# Altium schematic sheet preamp.SchDoc
size A4
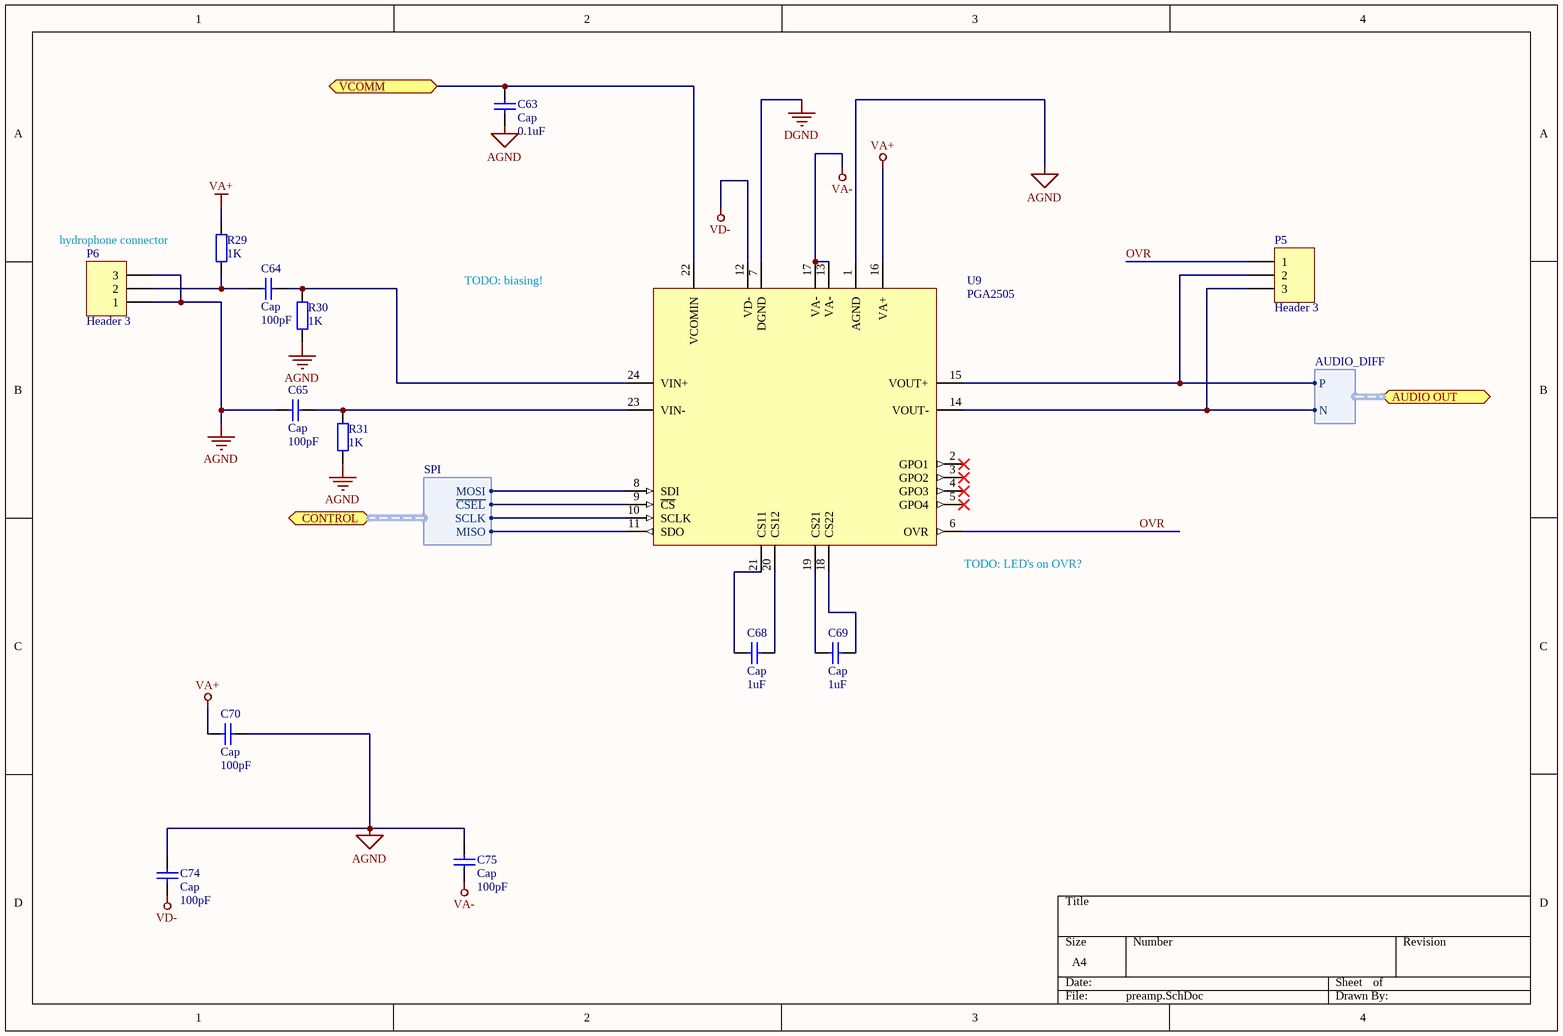
[diagram p0: preamp.SchDoc]

## Parts
C63  Cap  value 0.1uF  [C0603]
C64  Cap  value 100pF  [C0603]
C65  Cap  value 100pF  [C0603]
C68  Cap  value 1uF  [C0603]
C69  Cap  value 1uF  [C0603]
C70  Cap  value 100pF  [C0603]
C74  Cap  value 100pF  [C0603]
C75  Cap  value 100pF  [C0603]
P5  Header 3  [HDR1X3]
P6  Header 3  [S03B-PASK-2]
R29  value 1K  [R0603]  (hidden comment: Res2)
R30  value 1K  [R0603]  (hidden comment: Res2)
R31  value 1K  [R0603]  (hidden comment: Res2)
U9  PGA2505  [SOP65P780X200-24N]

## Ports
AUDIO OUT (harness AUDIO_DIFF), CONTROL (harness SPI), VCOMM

## Harnesses
SPI: ~{CSEL}, MISO, MOSI, SCLK
AUDIO_DIFF: N, P

## Nets
AGND: C63.1 C65.2 C70.2 C74.2 C75.2 P6.1 P6.3 R30.1 R31.1 U9.1(AGND)
DGND: U9.7(DGND)
VA+: C70.1 R29.2 U9.16(VA+)
VA-: C75.1 U9.13(VA-) U9.17(VA-)
VD-: C74.1 U9.12(VD-)
OVR: P5.1 U9.6(OVR)
VCOMM: C63.2 U9.22(VCOMIN) ; port VCOMM
NetC64_1: C64.1 R30.2 U9.24(VIN+)
NetC64_2: C64.2 P6.2 R29.1
NetC65_1: C65.1 R31.2 U9.23(VIN-)
NetC68_1: C68.1 U9.21(CS11)
NetC68_2: C68.2 U9.20(CS12)
NetC69_1: C69.1 U9.19(CS21)
NetC69_2: C69.2 U9.18(CS22)
NetP5_2: P5.2 U9.15(VOUT+) ; port AUDIO OUT.P
NetP5_3: P5.3 U9.14(VOUT-) ; port AUDIO OUT.N
NetU9_8: U9.8(SDI) ; port CONTROL.MOSI
NetU9_9: U9.9(~{CS}) ; port CONTROL.~{CSEL}
NetU9_10: U9.10(SCLK) ; port CONTROL.SCLK
NetU9_11: U9.11(SDO) ; port CONTROL.MISO

Not connected (* = marked no-connect by the designer): U9 2(GPO1)* 3(GPO2)* 4(GPO3)* 5(GPO4)*

## Notes on the sheet
- hydrophone connector
- TODO: biasing!
- (near U9) TODO: LED's on OVR?

## Library data of the parts
C63-C65 C68-C70 C74 C75 = Cap: Capacitor; Published: 8-Jun-2000; LatestRevisionDate: 17-Jul-2002; LatestRevisionNote: Re-released for DXP Platform.; PackageReference: RAD-0.3; Publisher: Altium Limited
P5 P6 = Header 3: Header, 3-Pin; LatestRevisionDate: 17-Jul-2002; LatestRevisionNote: Re-released for DXP Platform.; Publisher: Altium Limited
R29-R31 = Res2: Resistor; Published: 8-Jun-2000; LatestRevisionDate: 17-Jul-2002; LatestRevisionNote: Re-released for DXP Platform.; PackageReference: AXIAL-0.4; Publisher: Altium Limited
U9 = PGA2505: IC, MICROPHONE AMP, 24TSSOP; farnell: 1735567